# Altium schematic sheet Schematic.SchDoc
size A4
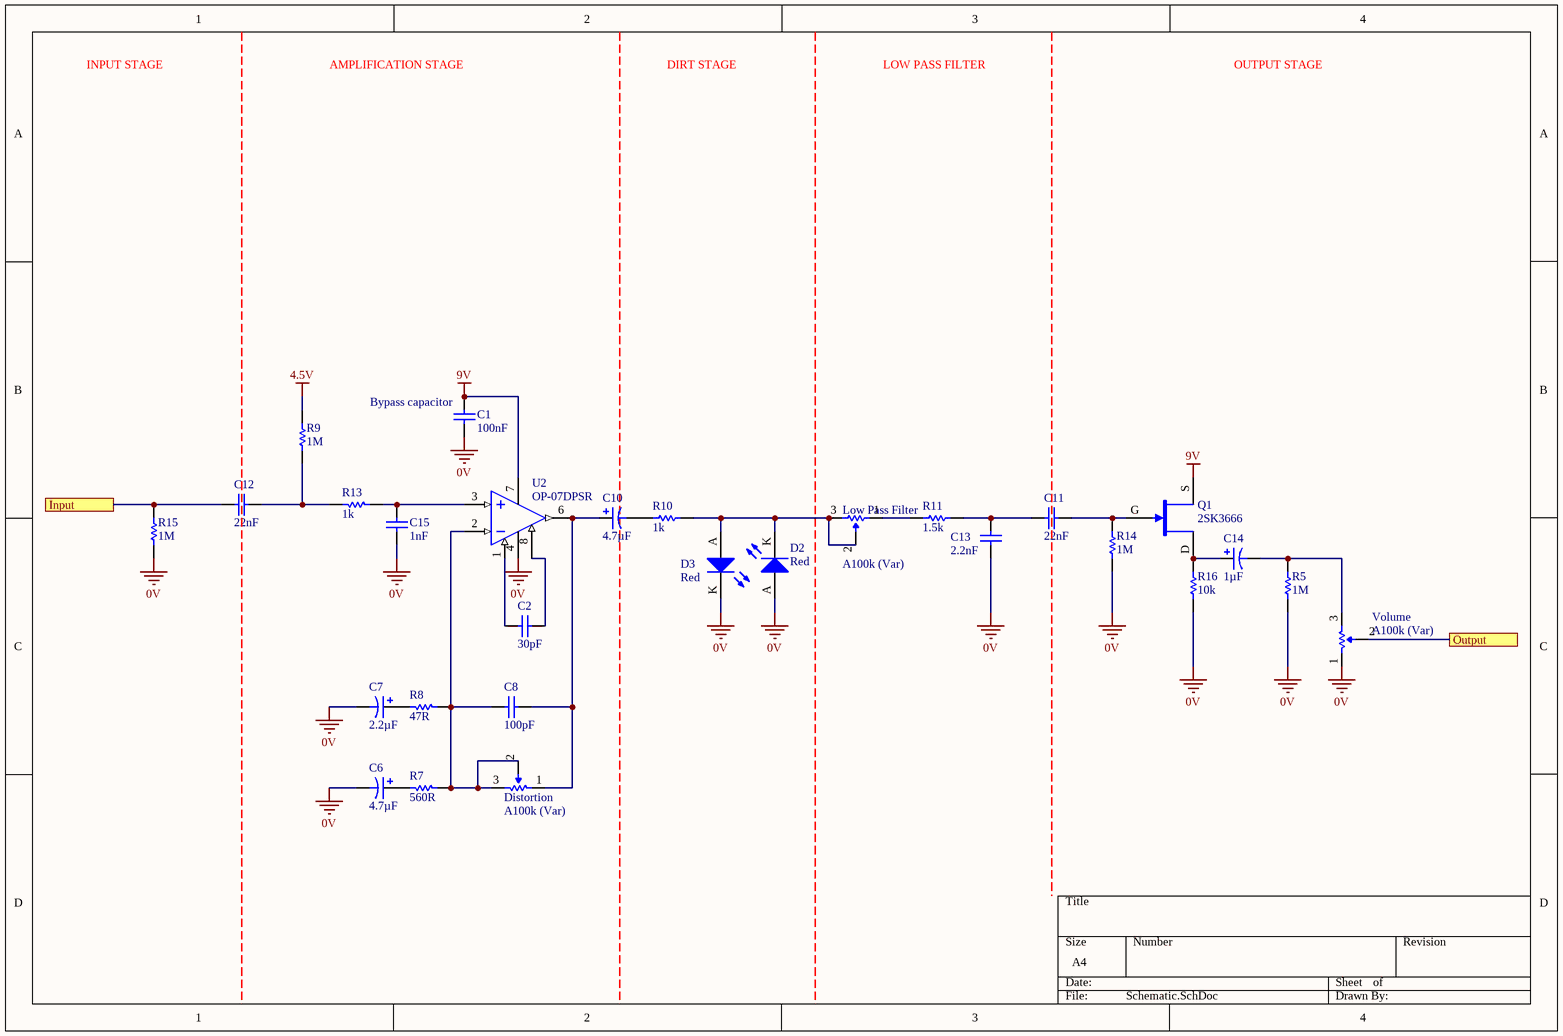
[diagram p0: Schematic.SchDoc]

## Parts
C1  100nF  [0805]
C2  30pF  [0805]
C6  4.7µF  [1206]
C7  2.2µF  [1206]
C8  100pF  [0805]
C10  4.7µF  [1206]
C11  22nF  [0805]
C12  22nF  [0805]
C13  2.2nF  [0805]
C14  1µF  [1206]
C15  1nF  [0805]
D2  Red  [0805 LED]
D3  Red  [0805 LED]
Distortion  A100k (Var)  [16mm PCB Mount Pot]
Low_Pass_Filter  A100k (Var)  [16mm PCB Mount Pot]
Q1  2SK3666  [ON SOT-23 JFET]
R5  1M  [0805]
R7  560R  [0805]
R8  47R  [0805]
R9  1M  [0805]
R10  1k  [0805]
R11  1.5k  [0805]
R13  1k  [0805]
R14  1M  [0805]
R15  1M  [0805]
R16  10k  [0805]
U2  OP-07DPSR  [TI 8-SOIC-W]
Volume  A100k (Var)  [16mm PCB Mount Pot]

## Ports
Input, Output

## Nets
0V: C1.1 C6.1 C7.1 C13.1 C15.1 D2.A D3.K R5.1 R14.1 R15.1 R16.1 U2.4(VCC-) Volume.1(CCW)
4.5V: R9.2
9V: C1.2 Q1.S U2.7(VCC+)
Input: C12.1 R15.2 ; port Input
Output: Volume.2(Wiper) ; port Output
NetC2_1: C2.1 U2.1(OFFSET_N1)
NetC2_2: C2.2 U2.8(OFFSET_N2)
NetC6_2: C6.2 R7.1
NetC7_2: C7.2 R8.1
NetC8_1: C8.1 Distortion.2(Wiper) Distortion.3(CW) R7.2 R8.2 U2.2(IN-)
NetC8_2: C8.2 C10.2 Distortion.1(CCW) U2.6(OUT)
NetC10_1: C10.1 R10.1
NetC11_1: C11.1 C13.2 R11.2
NetC11_2: C11.2 Q1.G R14.2
NetC12_2: C12.2 R9.1 R13.1
NetC14_1: C14.1 R5.2 Volume.3(CW)
NetC14_2: C14.2 Q1.D R16.2
NetC15_2: C15.2 R13.2 U2.3(IN+)
NetD2_K: D2.K D3.A Low_Pass_Filter.2(Wiper) Low_Pass_Filter.3(CW) R10.2
NetLow_Pass_Filter_1: Low_Pass_Filter.1(CCW) R11.1

## Notes on the sheet
- INPUT STAGE
- AMPLIFICATION STAGE
- DIRT STAGE
- LOW PASS FILTER
- OUTPUT STAGE
- (near C1) Bypass capacitor

## Library data of the parts
C1 = GCM21BR71H104KA37L: Manufacturer: muRata; Tolerance: ±10%; Material: X7R; Rated Voltage: 50V; Part Number: GCM21BR71H104KA37L; Value: 100nF; Digikey Part Number: 490-6064-1-ND
C2 = GCM21B5C1H300JA37L: Manufacturer: muRata; Tolerance: 5%; Material: C0G; Rated Voltage: 50V; Part Number: GCM21B5C1H300JA37L; Value: 30pF; Digikey Part Number: DO NOT USE FOR NEW DESIGNS
C6 C10 = TAJA475K025RNJ: Manufacturer: AVX Corporation; Tolerance: ±10%; Material: Tantalum; Rated Voltage: 25V; Part Number: TAJA475K025RNJ; Value: 4.7µF; Digikey Part Number: 478-11053-1-ND
C7 = TAJA225K025RNJ: Manufacturer: AVX Corporation; Tolerance: ±10%; Material: Tantalum; Rated Voltage: 25V; Part Number: TAJA225K025RNJ; Value: 2.2µF; Digikey Part Number: 478-1662-1-ND
C8 = GCM2165C1H101JA16D: Manufacturer: muRata; Tolerance: ±5%; Material: C0G, NP0; Rated Voltage: 50V; Part Number: GCM2165C1H101JA16D; Value: 100pF; Digikey Part Number: 490-8031-1-ND
C11 C12 = GCM21B5C1H223JA16L: Manufacturer: muRata; Tolerance: ±5%; Material: C0G, NP0; Rated Voltage: 50V; Part Number: GCM21B5C1H223JA16L; Value: 22nF; Digikey Part Number: 490-5318-1-ND
C13 = GCM2165C1H222JA16D: Manufacturer: muRata; Tolerance: ±5%; Material: C0G, NP0; Rated Voltage: 50V; Part Number: GCM2165C1H222JA16D; Value: 2.2nF; Digikey Part Number: 490-8033-1-ND
C14 = TAJA105K025RNJ: Manufacturer: AVX Corporation; Tolerance: ±10%; Material: Tantalum; Rated Voltage: 25V; Part Number: TAJA105K025RNJ; Value: 1µF; Digikey Part Number: 478-2363-1-ND
C15 = GCM2165C1H102JA16D: Manufacturer: muRata; Tolerance: ±5%; Material: C0G, NP0; Rated Voltage: 50V; Part Number: GCM2165C1H102JA16D; Value: 1nF; Digikey Part Number: 490-8032-1-ND
D2 D3 = SML-210LTT86: Red LED Indication - Discrete 1.75V 0805 (2012 Metric); Manufacturer: ROHM Semiconductor; Part Number: SML-210LTT86; Colour: Red; Digikey Part Number: 511-1286-1-ND; Digikey Link: https://www.digikey.com/product-detail/en/rohm-semiconductor/SML-210LTT86/511-1286-1-ND/637099
Distortion Low_Pass_Filter Volume = 502-0317: Manufacturer: NTE Electronics; Tolerance: 0.2; Rated Voltage: 0.1W; Part Number: 502-0317; Value: A100k (Var); Digikey Part Number: 2368-502-0317-ND
Q1 = 2SK3666: JFET N-Channel 10mA 200mW Surface Mount 3-CP; Manufacturer: ON Semiconductor; Published: 24-Mar-1999; LatestRevisionDate: 29-May-2009; LatestRevisionNote: IPC-7351 Footprint Added.; PackageVersion: Sep-2000; PackageReference: SOT-343; Publisher: Altium Limited; PackageDescription: 4-Pin SOT-343 Package 1.3 mm Pitch, 2.1 mm Lead Span; Part Number: 2SK3666; Digikey Part Number: 869-1107-1-ND; Digikey Link: https://www.digikey.com/product-detail/en/on-semiconductor/2SK3666-3-TB-E/869-1107-1-ND/2165585
R5 R9 R14 R15 = RC0805FR071ML: Manufacturer: YAGEO; Tolerance: 0.01; Rated Voltage: 0.125W; Part Number: RC0805FR071ML; Value: 1M; Material: FR-07; Digikey Part Number: 311-1.00MCRCT-ND
R7 = RC0805FR07560RL: Manufacturer: YAGEO; Tolerance: 0.01; Rated Voltage: 0.125W; Part Number: RC0805FR07560RL; Value: 560R; Material: FR-07; Digikey Part Number: 311-560CRCT-ND
R8 = RC0805FR0747RL: Manufacturer: YAGEO; Tolerance: 0.01; Rated Voltage: 0.125W; Part Number: RC0805FR0747RL; Value: 47R; Material: FR-07; Digikey Part Number: 311-47.0CRCT-ND
R10 R13 = RC0805FR071KL: Manufacturer: YAGEO; Tolerance: 0.01; Rated Voltage: 0.125W; Part Number: RC0805FR071KL; Value: 1k; Material: FR-07; Digikey Part Number: 311-1.00KCRCT-ND
R11 = RC0805FR071K5L: Manufacturer: YAGEO; Tolerance: 0.01; Rated Voltage: 0.125W; Part Number: RC0805FR071K5L; Value: 1.5k; Material: FR-07; Digikey Part Number: 311-1.50KCRCT-ND
R16 = RC0805FR0710KL: Manufacturer: YAGEO; Tolerance: 0.01; Rated Voltage: 0.125W; Part Number: RC0805FR0710KL; Value: 10k; Material: FR-07; Digikey Part Number: 311-10.0KCRCT-ND
U2 = OP-07DPSR: General Purpose Amplifier 1 Circuit 8-SO; Manufacturer: Texas Instruments; Part Number: OP-07DPSR; Digikey Part Number: 296-14171-2-ND; Digikey Link: https://www.digikey.com/product-detail/en/texas-instruments/OP-07DPSR/296-14171-2-ND/525998